# EAGLE design Super Simple Mosfet H-Bridge (EAGLE 6.4)
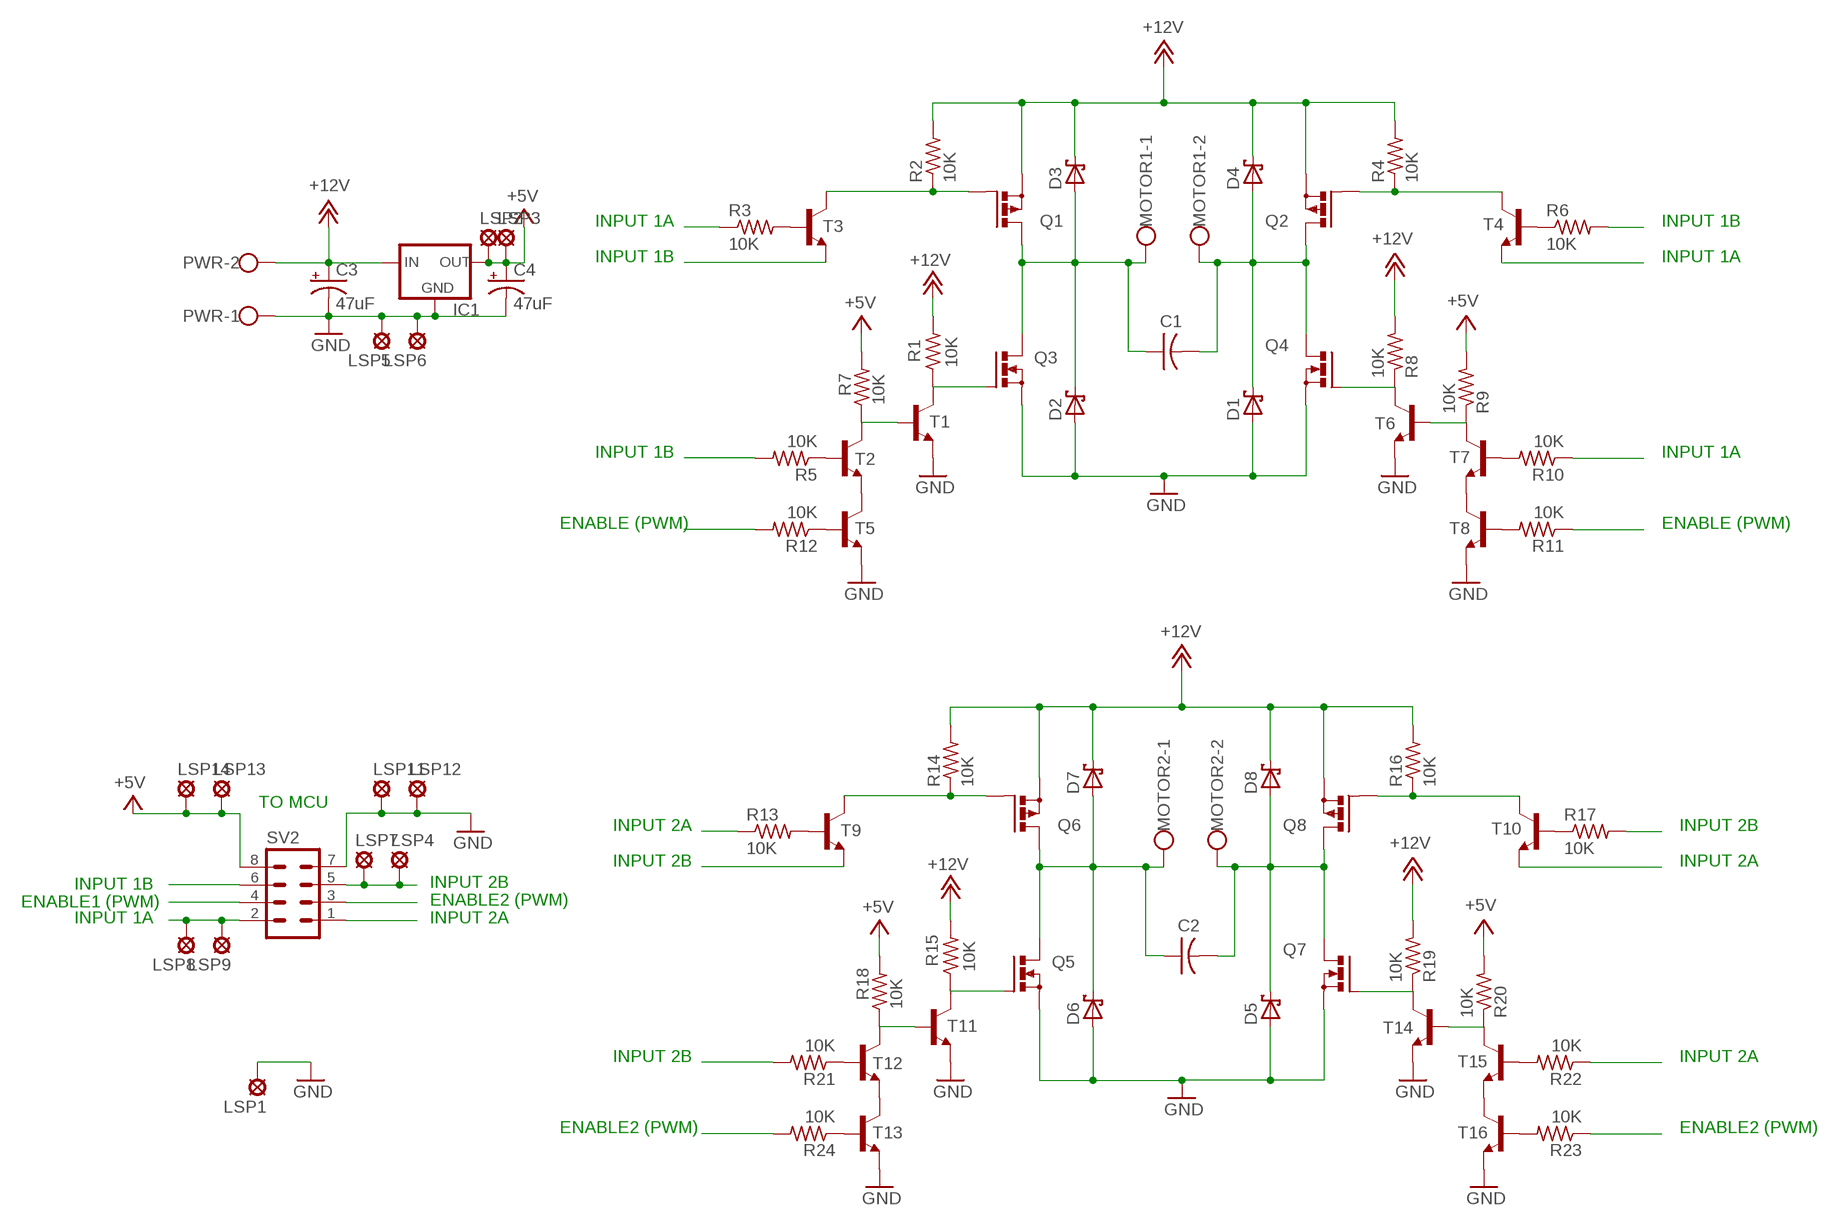
[diagram p0: schematic, sheet 1]

## Parts
C1  C-US050-025X075  [C050-025X075]
C2  C-US050-025X075  [C050-025X075]
C3  47uF  CPOL-USE2,5-6E  [E2,5-6E]
C4  47uF  CPOL-USE2,5-6E  [E2,5-6E]
D1  1N5817-B  [DO41-7.6]
D2  1N5817-B  [DO41-7.6]
D3  1N5817-B  [DO41-7.6]
D4  1N5817-B  [DO41-7.6]
D5  1N5817-B  [DO41-7.6]
D6  1N5817-B  [DO41-7.6]
D7  1N5817-B  [DO41-7.6]
D8  1N5817-B  [DO41-7.6]
IC1  78XXS  [78XXS]
LSP1  LSP13  [LSP13]
LSP2  LSP13  [LSP13]
LSP3  LSP13  [LSP13]
LSP4  LSP13  [LSP13]
LSP5  LSP13  [LSP13]
LSP6  LSP13  [LSP13]
LSP7  LSP13  [LSP13]
LSP8  LSP13  [LSP13]
LSP9  LSP13  [LSP13]
LSP11  LSP13  [LSP13]
LSP12  LSP13  [LSP13]
LSP13  LSP13  [LSP13]
LSP14  LSP13  [LSP13]
MOTOR1  W237-102  [W237-102]
MOTOR2  W237-102  [W237-102]
PWR  W237-102  [W237-102]
Q1  IRF9640  PMOSFET_PTO220BV  [TO220BV]
Q2  IRF9640  PMOSFET_PTO220BV  [TO220BV]
Q3  IRF530N  PMOSFET_NTO220BV  [TO220BV]
Q4  IRF530N  PMOSFET_NTO220BV  [TO220BV]
Q5  IRF530N  PMOSFET_NTO220BV  [TO220BV]
Q6  IRF9640  PMOSFET_PTO220BV  [TO220BV]
Q7  IRF530N  PMOSFET_NTO220BV  [TO220BV]
Q8  IRF9640  PMOSFET_PTO220BV  [TO220BV]
R1  10K  R-US_0207/10  [0207/10]
R2  10K  R-US_0207/10  [0207/10]
R3  10K  R-US_0207/10  [0207/10]
R4  10K  R-US_0207/10  [0207/10]
R5  10K  R-US_0207/10  [0207/10]
R6  10K  R-US_0207/10  [0207/10]
R7  10K  R-US_0207/10  [0207/10]
R8  10K  R-US_0207/10  [0207/10]
R9  10K  R-US_0207/10  [0207/10]
R10  10K  R-US_0207/10  [0207/10]
R11  10K  R-US_0207/10  [0207/10]
R12  10K  R-US_0207/10  [0207/10]
R13  10K  R-US_0207/10  [0207/10]
R14  10K  R-US_0207/10  [0207/10]
R15  10K  R-US_0207/10  [0207/10]
R16  10K  R-US_0207/10  [0207/10]
R17  10K  R-US_0207/10  [0207/10]
R18  10K  R-US_0207/10  [0207/10]
R19  10K  R-US_0207/10  [0207/10]
R20  10K  R-US_0207/10  [0207/10]
R21  10K  R-US_0207/10  [0207/10]
R22  10K  R-US_0207/10  [0207/10]
R23  10K  R-US_0207/10  [0207/10]
R24  10K  R-US_0207/10  [0207/10]
SV2  MA04-2  [MA04-2]
T1  -NPN-TO92-EBC  [TO92-EBC]
T2  -NPN-TO92-EBC  [TO92-EBC]
T3  -NPN-TO92-EBC  [TO92-EBC]
T4  -NPN-TO92-EBC  [TO92-EBC]
T5  -NPN-TO92-EBC  [TO92-EBC]
T6  -NPN-TO92-EBC  [TO92-EBC]
T7  -NPN-TO92-EBC  [TO92-EBC]
T8  -NPN-TO92-EBC  [TO92-EBC]
T9  -NPN-TO92-EBC  [TO92-EBC]
T10  -NPN-TO92-EBC  [TO92-EBC]
T11  -NPN-TO92-EBC  [TO92-EBC]
T12  -NPN-TO92-EBC  [TO92-EBC]
T13  -NPN-TO92-EBC  [TO92-EBC]
T14  -NPN-TO92-EBC  [TO92-EBC]
T15  -NPN-TO92-EBC  [TO92-EBC]
T16  -NPN-TO92-EBC  [TO92-EBC]

## Nets
1A: LSP8.MP LSP9.MP R3.1 R10.1 SV2.2 T4.E
1B: R5.2 R6.2 SV2.6 T3.E
2A: R13.1 R22.1 SV2.1 T10.E
2B: LSP4.MP LSP7.MP R17.2 R21.2 SV2.5 T9.E
+5V: C4.+ IC1.OUT LSP2.MP LSP3.MP LSP13.MP LSP14.MP R7.2 R9.2 R18.2 R20.2 SV2.8
+12V [Thick]: C3.+ D3.C D4.C D7.C D8.C IC1.IN PWR.2 Q1.S Q2.S Q6.S Q8.S R1.2 R2.2 R4.2 R8.2 R14.2 R15.2 R16.2 R19.2
ENABLE1: R11.1 R12.2 SV2.4
ENABLE2: R23.1 R24.2 SV2.3
GND [Thick]: C3.- C4.- D1.A D2.A D5.A D6.A IC1.GND LSP1.MP LSP5.MP LSP6.MP LSP11.MP LSP12.MP PWR.1 Q3.S Q4.S Q5.S Q7.S SV2.7 T1.E T5.E T6.E T8.E T11.E T13.E T14.E T16.E
N$1: R3.2 T3.B
N$2: Q1.G R2.1 T3.C
N$3 [Thick]: C1.1 D2.C D3.A MOTOR1.1 Q1.D Q3.D
N$4: Q2.G R4.1 T4.C
N$5: R6.1 T4.B
N$6: Q3.G R1.1 T1.C
N$7 [Thick]: C1.2 D1.C D4.A MOTOR1.2 Q2.D Q4.D
N$8: R7.1 T1.B T2.C
N$9: T2.E T5.C
N$10: Q4.G R8.1 T6.C
N$11: R9.1 T6.B T7.C
N$12: Q6.G R14.1 T9.C
N$13: T7.E T8.C
N$14 [Thick]: C2.1 D6.C D7.A MOTOR2.1 Q5.D Q6.D
N$15: Q8.G R16.1 T10.C
N$16 [Thick]: C2.2 D5.C D8.A MOTOR2.2 Q7.D Q8.D
N$17: R13.2 T9.B
N$18: R17.1 T10.B
N$19: Q5.G R15.1 T11.C
N$20: R18.1 T11.B T12.C
N$21: R5.1 T2.B
N$22: R10.2 T7.B
N$23: R11.2 T8.B
N$24: R12.1 T5.B
N$25: T12.E T13.C
N$26: Q7.G R19.1 T14.C
N$27: R20.1 T14.B T15.C
N$28: T15.E T16.C
N$29: R21.1 T12.B
N$30: R22.2 T15.B
N$31: R23.2 T16.B
N$32: R24.1 T13.B

## Notes on the sheet
- INPUT 1A | INPUT 1B
- INPUT 1B | INPUT 1A
- INPUT 1B | INPUT 1A
- ENABLE (PWM) | ENABLE (PWM)
- TO MCU
- INPUT 2A | INPUT 2B
- INPUT 2B | INPUT 2A
- INPUT 1B | INPUT 2B
- ENABLE1 (PWM) | ENABLE2 (PWM)
- INPUT 1A | INPUT 2A
- INPUT 2B | INPUT 2A
- ENABLE2 (PWM) | ENABLE2 (PWM)

## Library data of the parts
C1 C2 = rcl:C-US: CAPACITOR, American symbol
C3 C4 = rcl:CPOL-US: POLARIZED CAPACITOR, American symbol
D1-D8 = diode:1N581*: 1.0A SCHOTTKY BARRIER RECTIFIER Source: http://www.diodes.com/datasheets/ds23001.pdf
IC1 = v-reg:78XXS: VOLTAGE REGULATOR
LSP1-LSP9 LSP11-LSP14 = solpad:LSP13: SOLDER PAD drill 1.3 mm, distributor Buerklin, 12H562
MOTOR1 MOTOR2 PWR = con-wago-500:W237-102: WAGO SCREW CLAMP; MPN: 237-102; OC_FARNELL: unknown; OC_NEWARK: 70K9898
Q1 Q2 Q6 Q8 = transistor-power:PMOSFET_P: Power MOSFET P-Channel
Q3-Q5 Q7 = transistor-power:PMOSFET_N: Power MOSFET N-Channel
R1-R24 = rcl:R-US_: RESISTOR, American symbol
SV2 = con-lstb:MA04-2: PIN HEADER; OC_FARNELL: unknown; OC_NEWARK: unknown
T1-T16 = transistor:*-NPN-: NPN Transistror BF959 corrected 2008.03.06

## Net classes
1 Thick: width 1.016 mm, drill 0.508 mm, clearance 0.508 mm

## Board
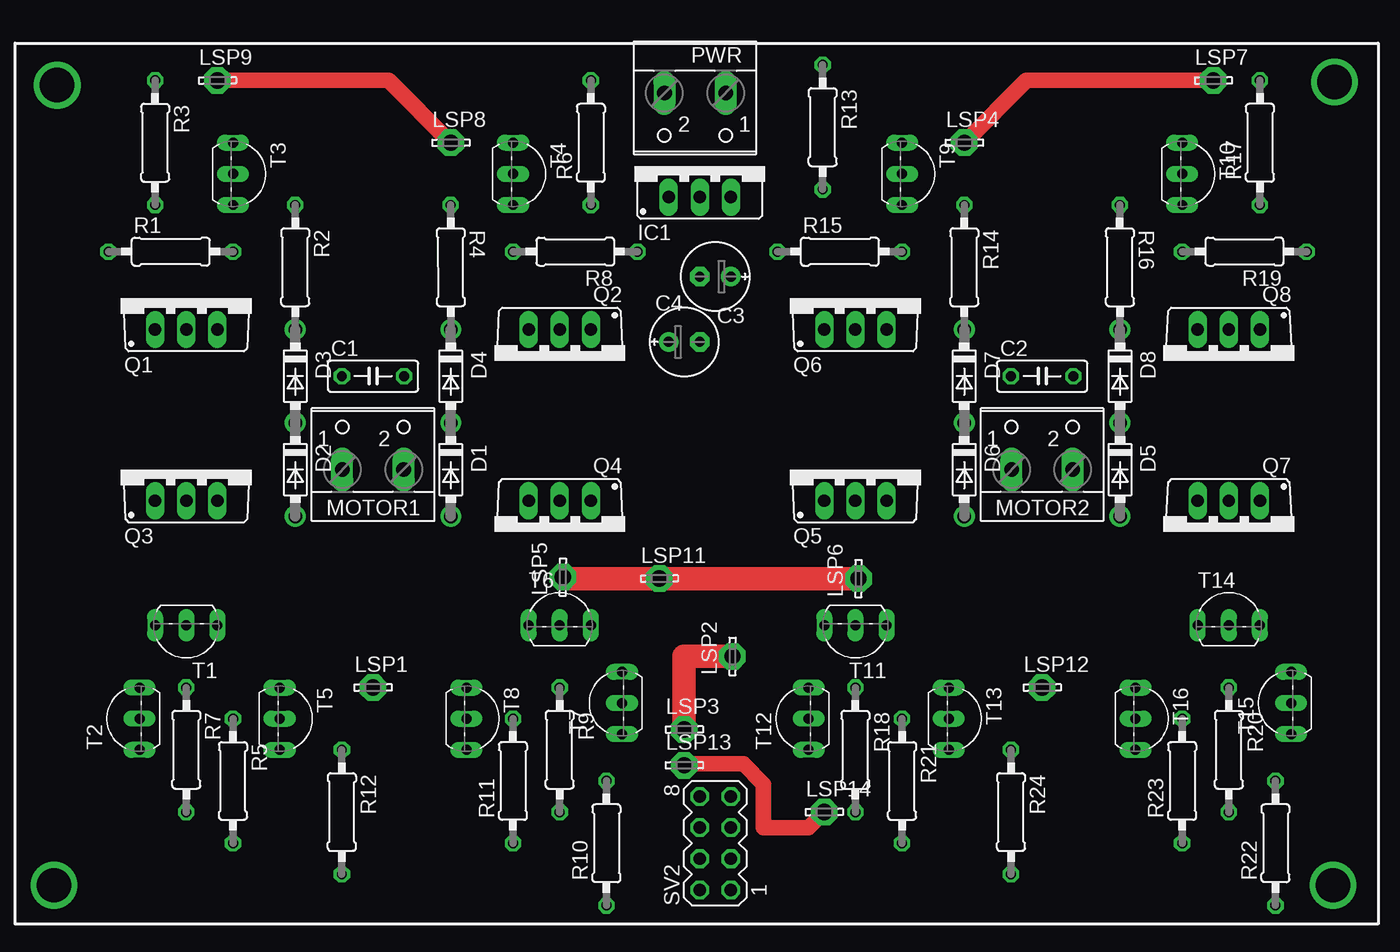
[diagram p1: board, top side]
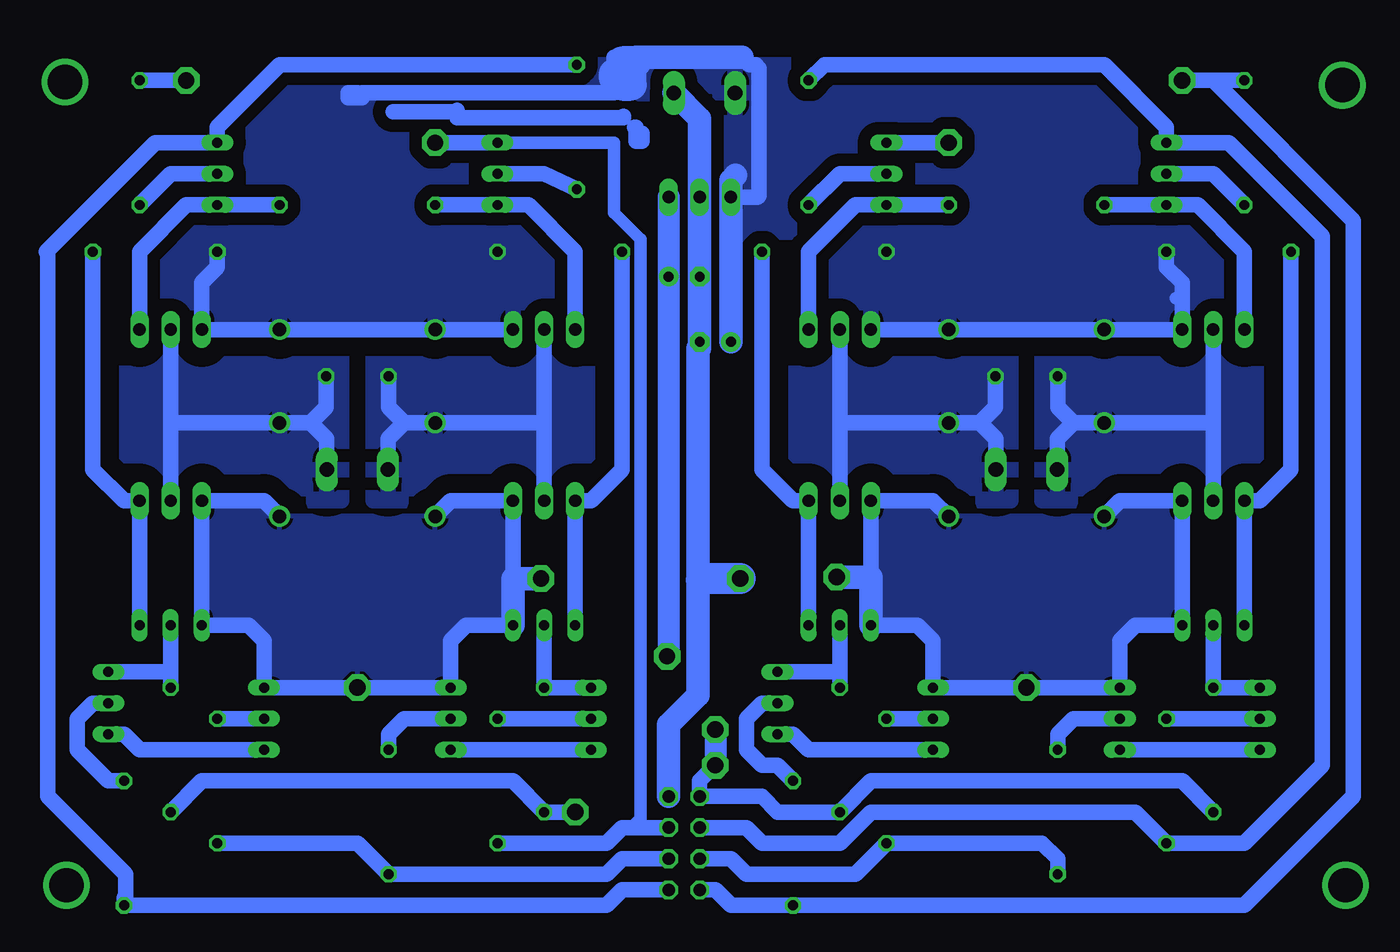
[diagram p2: board, bottom side, seen from below]

No outline drawn. Coordinates in mm, seen from the top.
Copper layers (1*16): Top 0.035mm / dielectric 1.5mm / Bottom 0.035mm
Design rules "default": minimum track width 10mil, minimum drill 24mil, track to track 8mil, track to pad 8mil, pad to pad 8mil, via to via 8mil, smd to smd 8mil, copper to edge 40mil, drill to drill 8mil, minimum pad ring 10mil, minimum via ring 8mil, stop-mask expansion 4mil, vias tented up to drill 0mil, thermal gap 10mil

### Footprints (pad centres in the part's own frame; a part is rotated, then mirrored left to right if it is on the bottom)
C050-025X075 = drill 0.813 octagon: 1 -2.54,0; 2 2.54,0
E2,5-6E = drill 0.813 pad 1.575: + -1.27,0 | drill 0.813 pad 1.575 octagon: - 1.27,0
DO41-7.6 = drill 1.1 pad 1.7: A 3.81,0; C -3.81,0
78XXS = drill 1.016 long: GND 0,-2.54; IN -2.54,-2.54; OUT 2.54,-2.54
LSP13 = drill 1.321 pad 2.159 octagon: MP 0,0
W237-102 = drill 1.194 long: 1 -2.5,-1.27; 2 2.5,-1.27
TO220BV = drill 1.016 long: D 0,-2.54; G -2.54,-2.54; S 2.54,-2.54
0207/10 = drill 0.813 octagon: 1 -5.08,0; 2 5.08,0
MA04-2 = drill 1.016 octagon: 1 -3.81,-1.27; 2 -3.81,1.27; 3 -1.27,-1.27; 4 -1.27,1.27; 5 1.27,-1.27; 6 1.27,1.27; 7 3.81,-1.27; 8 3.81,1.27
TO92-EBC = drill 0.813 long: B 0,-1.27; C 2.54,-1.27; E -2.54,-1.27

### Placement (x,y rotation side)
C1  22.86,44.45 0 top
C2  77.47,44.45 0 top
C3  48.26,47.24 0 top
C4  50.8,52.58 180 top
D1  29.21,36.83 270 top
D2  16.51,36.83 270 top
D3  16.51,44.45 270 top
D4  29.21,44.45 270 top
D5  83.82,36.83 270 top
D6  71.12,36.83 270 top
D7  71.12,44.45 270 top
D8  83.82,44.45 270 top
IC1  49.53,61.59 0 top
LSP1  22.86,19.05 0 top
LSP2  52.2,21.59 90 top
LSP3  48.26,15.62 0 top
LSP4  71.12,63.5 0 top
LSP5  38.35,28.07 90 top
LSP6  62.48,27.94 90 top
LSP7  91.44,68.58 0 top
LSP8  29.21,63.5 0 top
LSP9  10.16,68.58 0 top
LSP11  46.23,27.94 0 top
LSP12  77.47,19.05 0 top
LSP13  48.26,12.7 0 top
LSP14  59.69,8.89 0 top
MOTOR1  22.86,38.1 0 top
MOTOR2  77.47,38.1 0 top
PWR  49.15,66.29 180 top
Q1  7.62,50.8 0 top
Q2  38.1,45.72 180 top
Q3  7.62,36.83 0 top
Q4  38.1,31.75 180 top
Q5  62.23,36.83 0 top
Q6  62.23,50.8 0 top
Q7  92.71,31.75 180 top
Q8  92.71,45.72 180 top
R1  6.35,54.61 0 top
R2  16.51,53.34 270 top
R3  5.08,63.5 270 top
R4  29.21,53.34 270.1 top
R5  11.43,11.43 270 top
R6  40.64,63.5 90 top
R7  7.62,13.97 270 top
R8  39.37,54.61 180 top
R9  38.1,13.97 270 top
R10  41.91,6.35 90 top
R11  34.29,11.43 90 top
R12  20.32,8.89 270 top
R13  59.56,64.77 270 top
R14  71.12,53.34 270 top
R15  60.96,54.61 0 top
R16  83.82,53.34 270.1 top
R17  95.25,63.5 90 top
R18  62.23,13.97 270 top
R19  93.98,54.61 180 top
R20  92.71,13.97 270 top
R21  66.04,11.43 270 top
R22  96.52,6.35 90 top
R23  88.9,11.43 90 top
R24  74.93,8.89 270 top
SV2  50.8,6.35 90 top
T1  7.62,22.86 180 top
T2  2.54,16.51 90 top
T3  12.7,60.96 270 top
T4  35.56,60.96 270 top
T5  16.51,16.51 270 top
T6  38.1,25.4 0 top
T7  41.91,17.78 90 top
T8  31.75,16.51 270 top
T9  67.31,60.96 270 top
T10  90.17,60.96 270 top
T11  62.23,22.86 180 top
T12  57.15,16.51 90 top
T13  71.12,16.51 270 top
T14  92.71,25.4 0 top
T15  96.52,17.78 90 top
T16  86.36,16.51 270 top

### Tracks (layer width: path | path; a pad name or v marks a point on that pad's centre or on a via)
1A
  Top 1.27: LSP9.MP 24.13,68.58 LSP8.MP
  Bottom 1.27: SV2.2 48.26,2.54 46.99,1.27 R10.1 5.08,1.27 -3.81,10.16 -3.81,57.15 7.62,68.58 LSP9.MP R3.1 | LSP8.MP T4.E
1B
  Bottom 1.27: SV2.6 45.72,7.62 44.45,6.35 38.1,6.35 35.56,8.89 13.97,8.89 R5.2 5.08,6.35 -1.27,12.7 -1.27,55.88 6.35,63.5 T3.E 11.43,64.77 16.51,69.85 39.37,69.85 R6.2
2A
  Bottom 1.27: SV2.1 55.88,2.54 57.15,1.27 R22.1 96.52,1.91 96.39,2.03 96.39,3.81 102.74,10.16 102.74,54.61 102.87,54.61 93.98,63.5 T10.E 88.9,64.77 83.82,69.85 R13.1
2B
  Top 1.27: LSP7.MP 76.2,68.58 LSP4.MP
  Bottom 1.016: 66.67,63.5 56.52,63.5 56.52,57.78 54.36,55.63 54.36,8.38 55.12,7.62
  Bottom 1.27: R21.2 57.15,6.35 55.88,7.62 55.12,7.62 SV2.5 54.61,7.62 | T9.E 66.67,63.5 LSP4.MP | R17.2 LSP7.MP
+5V
  Top 1.27: LSP14.MP 58.42,7.62 54.74,7.62 54.74,11.18 53.09,12.83 48.39,12.83 LSP13.MP
  Top 1.93: LSP2.MP 48.26,21.59 LSP3.MP
  Bottom 1.27: R7.2 10.16,11.43 35.56,11.43 R9.2 43.18,8.89 44.45,10.16 SV2.8 49.53,11.43 LSP13.MP | R20.2 90.17,11.43 64.77,11.43 R18.2 LSP14.MP
  Bottom 1.778: IC1.OUT C4.+ 52.07,21.72 LSP2.MP | LSP3.MP LSP13.MP
+12V
  Top 1.016: D8.C R16.2 | R4.2 29.46,48.26 D4.C
  Bottom 1.016: 10.67,50.8 10.16,50.8 | 47.24,53.85 46.99,53.85 46.76,53.85
  Bottom 1.27: Q2.S D4.C D3.C Q1.S 10.16,50.8 10.16,52.07 11.43,53.34 R1.2 | Q6.S D7.C D8.C Q8.S 90.17,52.07 88.9,53.34 R19.2 | IC1.IN 44.83,59.05 44.7,59.18 44.7,69.6 44.96,69.85 45.47,69.85 46.1,70.48 | 56.52,70.48 56.52,68.83 56.52,67.56 77.09,67.56 77.09,67.18 78.23,67.18 78.23,67.56 77.47,67.56
  Bottom 1.93: C3.+ 46.99,53.85 46.99,60.45 46.61,60.83 | 46.1,70.48 54.74,70.48 54.74,70.1
  Bottom 2.54: 54.74,70.1 55.88,70.1 55.88,68.2 55.12,68.2 55.12,69.6 55.37,69.6 55.37,69.22 55.24,69.22 55.24,69.09 56.52,69.09 56.52,68.83
  pour Bottom (isolate 1.016): 2.54,69.85 2.54,48.26 97.79,49.53 97.79,69.85
ENABLE1
  Bottom 1.27: R12.2 20.32,5.08 21.59,6.35 R11.1 36.83,3.81 45.72,3.81 46.99,5.08 SV2.4
ENABLE2
  Bottom 1.27: R23.1 77.47,6.35 R24.2 57.15,3.81 55.88,5.08 SV2.3
GND
  Top 1.93: LSP5.MP arc90 38.48,27.94 LSP11.MP LSP6.MP
  Bottom 1.27: D2.A 15.24,34.29 Q3.S T1.E 13.97,24.13 15.24,22.86 T5.E LSP1.MP T8.E 30.48,22.86 31.75,24.13 T6.E Q4.S 30.48,34.29 D1.A | D6.A 69.85,34.29 Q5.S T11.E 68.58,24.13 69.85,22.86 T13.E LSP12.MP T16.E 85.09,22.86 86.36,24.13 T14.E Q7.S 85.09,34.29 D5.A
  Bottom 1.778: 49.4,27.81 49.66,28.07
  Bottom 1.93: PWR.1 49.53,65.44 IC1.GND C4.- C3.- 49.53,46.74 49.66,46.74 49.66,28.07 49.66,18.41 52.07,16 SV2.7 | T6.E 35.56,28.07 LSP5.MP | T11.E 64.77,27.94 LSP6.MP
  Bottom 2.54: LSP11.MP 49.28,27.94 49.4,27.81
  pour Bottom (isolate 2.032): 10.16,34.29 15.24,34.29 16.51,33.02 29.21,33.02 30.48,34.29 35.56,34.29 35.56,24.13 31.75,24.13 30.48,22.86 30.48,19.05 15.24,19.05 15.24,22.86 13.97,24.13 10.16,24.13
  pour Bottom (isolate 2.032): 64.77,34.29 69.85,34.29 71.12,33.02 83.82,33.02 85.09,34.29 90.17,34.29 90.17,24.13 86.36,24.13 85.09,22.86 85.09,19.05 69.85,19.05 69.85,22.86 68.58,24.13 64.77,24.13
N$1
  Bottom 1.27: T3.B 7.62,60.96 R3.2
N$2
  Bottom 1.27: Q1.G 5.08,54.61 8.89,58.42 T3.C R2.1
N$3
  Bottom 1.27: MOTOR1.1 20.36,39.33 19.05,40.64 | 19.05,40.64 D2.C 7.62,40.64 | 7.62,40.64 Q3.D | Q1.D 7.62,40.64 | C1.1 20.32,41.91 19.05,40.64
  pour Bottom (isolate 1.524): 2.54,48.26 21.59,48.26 21.59,34.29 2.54,34.29
N$4
  Bottom 1.27: Q2.G 40.64,54.61 36.83,58.42 T4.C | R4.1 T4.C | T4.C
N$5
  Bottom 1.27: T4.B 38.1,60.96 R6.1
N$6
  Bottom 1.27: R1.1 1.27,36.83 3.81,34.29 Q3.G T1.C
N$7
  Bottom 1.27: MOTOR1.2 25.36,39.33 26.67,40.64 | 26.67,40.64 D4.A 38.1,40.64 | 38.1,40.64 Q4.D | Q2.D 38.1,40.64 | C1.2 25.4,41.91 26.67,40.64
  pour Bottom (isolate 1.524): 24.13,48.26 43.18,48.26 43.18,34.29 24.13,34.29
N$8
  Bottom 1.27: T1.B R7.1 T2.C
N$9
  Bottom 1.27: T5.C T2.E
N$10
  Bottom 1.27: R8.1 44.45,36.83 41.91,34.29 Q4.G T6.C
N$11
  Bottom 1.27: T6.B 38.1,20.32 | 38.1,20.32 R9.1 | T7.C 38.1,20.32
N$12
  Bottom 1.27: Q6.G 59.69,54.61 63.5,58.42 T9.C R14.1
N$13
  Bottom 1.27: T8.C 40.64,13.97 41.91,15.24 T7.E
N$14
  Bottom 1.27: MOTOR2.1 74.97,39.33 73.66,40.64 | 73.66,40.64 D6.C 62.23,40.64 | 62.23,40.64 Q5.D | Q6.D 62.23,40.64 | C2.1 74.93,41.91 73.66,40.64
  pour Bottom (isolate 1.524): 57.15,48.26 76.2,48.26 76.2,34.29 57.15,34.29
N$15
  Bottom 1.27: Q8.G 95.25,54.61 91.44,58.42 T10.C | R16.1 T10.C | T10.C
N$16
  Bottom 1.27: MOTOR2.2 79.97,39.33 81.28,40.64 | 81.28,40.64 D8.A 92.71,40.64 | 92.71,40.64 Q7.D | Q8.D 92.71,40.64 | C2.2 80.01,41.91 81.28,40.64
  pour Bottom (isolate 1.524): 78.74,48.26 97.79,48.26 97.79,34.29 78.74,34.29
N$17
  Bottom 1.27: T9.B 62.23,60.96 R13.2
N$18
  Bottom 1.27: T10.B 92.71,60.96 R17.1
N$19
  Bottom 1.27: R15.1 55.88,36.83 58.42,34.29 Q5.G T11.C
N$20
  Bottom 1.27: T11.B R18.1 T12.C
N$21
  Bottom 1.27: R5.1 T2.B
N$22
  Bottom 1.27: R10.2 43.18,12.7 44.45,12.7 45.72,13.97 45.72,16.51 44.45,17.78 T7.B
N$23
  Bottom 1.27: T8.B R11.2
N$24
  Bottom 1.27: R12.1 20.32,15.24 19.05,16.51 T5.B
N$25
  Bottom 1.27: T13.C T12.E
N$26
  Bottom 1.27: R19.1 99.06,36.83 96.52,34.29 Q7.G T14.C
N$27
  Bottom 1.27: T14.B 92.71,20.32 | 92.71,20.32 R20.1 | T15.C 92.71,20.32
N$28
  Bottom 1.27: T16.C 95.25,13.97 96.52,15.24 T15.E
N$29
  Bottom 1.27: R21.1 T12.B
N$30
  Bottom 1.27: R22.2 97.79,11.43 100.33,13.97 100.33,16.51 99.06,17.78 T15.B
N$31
  Bottom 1.27: R23.2 T16.B
N$32
  Bottom 1.27: R24.1 74.93,15.24 73.66,16.51 T13.B
N$33  (via drill 2.8)
  other vias: -2.92,68.2
N$34
  Bottom 1.27: 55.75,65.66 55.75,65.53 69.34,65.53 69.34,66.04 | 69.34,66.17 69.34,66.04 | 69.34,66.04 74.55,66.04
N$35
  Bottom 1.27: 54.86,64.77 54.74,64.77 54.74,63.63 54.23,63.63 54.23,64.26
N$36  (via drill 2.8)
  other vias: -3.17,2.92
N$37  (via drill 2.8)
  other vias: 101.22,2.92
N$38  (via drill 2.8)
  other vias: 101.35,68.45